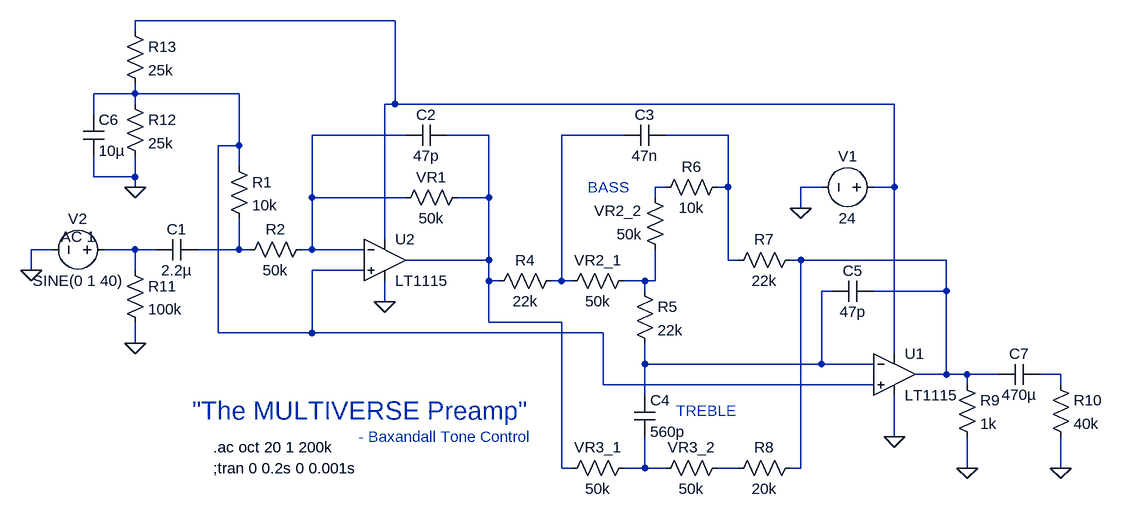
[diagram p0: schematic Baxandall Tone Control.asc]
Baxandall Tone Control.asc, the LTspice schematic file:
Version 4
SHEET 1 880 680
WIRE -432 -416 -832 -416
WIRE -832 -400 -832 -416
WIRE -832 -304 -832 -320
WIRE -832 -304 -896 -304
WIRE -672 -304 -832 -304
WIRE -832 -288 -832 -304
WIRE -432 -288 -432 -416
WIRE -432 -288 -448 -288
WIRE 336 -288 -432 -288
WIRE -896 -272 -896 -304
WIRE -416 -240 -560 -240
WIRE -288 -240 -352 -240
WIRE -80 -240 -176 -240
WIRE 80 -240 -16 -240
WIRE -672 -224 -672 -304
WIRE -672 -224 -704 -224
WIRE -672 -192 -672 -224
WIRE -896 -176 -896 -208
WIRE -832 -176 -832 -208
WIRE -832 -176 -896 -176
WIRE -832 -160 -832 -176
WIRE -16 -160 -32 -160
WIRE 80 -160 80 -240
WIRE 80 -160 64 -160
WIRE 224 -160 192 -160
WIRE 336 -160 336 -288
WIRE 336 -160 304 -160
WIRE -560 -144 -560 -240
WIRE -416 -144 -560 -144
WIRE -288 -144 -288 -240
WIRE -288 -144 -336 -144
WIRE -32 -144 -32 -160
WIRE 192 -128 192 -160
WIRE -448 -80 -448 -288
WIRE -960 -64 -992 -64
WIRE -832 -64 -880 -64
WIRE -800 -64 -832 -64
WIRE -672 -64 -672 -112
WIRE -672 -64 -736 -64
WIRE -656 -64 -672 -64
WIRE -560 -64 -560 -144
WIRE -560 -64 -576 -64
WIRE -480 -64 -560 -64
WIRE -288 -48 -288 -144
WIRE -288 -48 -416 -48
WIRE 80 -48 80 -160
WIRE 96 -48 80 -48
WIRE 192 -48 176 -48
WIRE 416 -48 192 -48
WIRE -992 -32 -992 -64
WIRE -832 -32 -832 -64
WIRE -480 -32 -560 -32
WIRE -288 -16 -288 -48
WIRE -272 -16 -288 -16
WIRE -176 -16 -176 -240
WIRE -176 -16 -192 -16
WIRE -160 -16 -176 -16
WIRE -48 -16 -80 -16
WIRE -32 -16 -32 -64
WIRE -32 -16 -48 -16
WIRE -48 0 -48 -16
WIRE 240 0 224 0
WIRE 416 0 416 -48
WIRE 416 0 304 0
WIRE -448 16 -448 -16
WIRE -288 48 -288 -16
WIRE -176 48 -288 48
WIRE -704 64 -704 -224
WIRE -560 64 -560 -32
WIRE -560 64 -704 64
WIRE -112 64 -560 64
WIRE -832 80 -832 48
WIRE 336 96 336 -160
WIRE -48 112 -48 80
WIRE 224 112 224 0
WIRE 224 112 -48 112
WIRE 304 112 224 112
WIRE 416 128 416 0
WIRE 416 128 368 128
WIRE 448 128 416 128
WIRE 496 128 448 128
WIRE 592 128 560 128
WIRE -112 144 -112 64
WIRE 304 144 -112 144
WIRE 448 144 448 128
WIRE 592 144 592 128
WIRE -48 160 -48 112
WIRE 336 224 336 160
WIRE -176 272 -176 48
WIRE -160 272 -176 272
WIRE -48 272 -48 224
WIRE -48 272 -80 272
WIRE -16 272 -48 272
WIRE 96 272 64 272
WIRE 192 272 192 -48
WIRE 192 272 176 272
WIRE 448 272 448 224
WIRE 592 272 592 224
FLAG 192 -128 0
FLAG 336 224 0
FLAG -448 16 0
FLAG 448 272 0
FLAG 592 272 0
FLAG -832 80 0
FLAG -992 -32 0
FLAG -832 -160 0
SYMBOL voltage 320 -160 R90
WINDOW 0 -32 56 VBottom 2
WINDOW 3 32 56 VTop 2
WINDOW 123 0 0 Left 2
WINDOW 39 0 0 Left 2
SYMATTR InstName V1
SYMATTR Value 24
SYMBOL res -16 -48 R180
WINDOW 0 36 76 Left 2
WINDOW 3 36 40 Left 2
SYMATTR InstName VR2_2
SYMATTR Value 50k
SYMBOL res 80 256 R90
WINDOW 0 0 56 VBottom 2
WINDOW 3 32 56 VTop 2
SYMATTR InstName VR3_2
SYMATTR Value 50k
SYMBOL res -64 256 R90
WINDOW 0 0 56 VBottom 2
WINDOW 3 32 56 VTop 2
SYMATTR InstName VR3_1
SYMATTR Value 50k
SYMBOL res -64 -32 R90
WINDOW 0 0 56 VBottom 2
WINDOW 3 32 56 VTop 2
SYMATTR InstName VR2_1
SYMATTR Value 50k
SYMBOL cap -64 160 R0
SYMATTR InstName C4
SYMATTR Value 560p
SYMATTR SpiceLine Rser=10m
SYMBOL res -64 -16 R0
SYMATTR InstName R5
SYMATTR Value 22k
SYMBOL res 192 -64 R90
WINDOW 0 0 56 VBottom 2
WINDOW 3 32 56 VTop 2
SYMATTR InstName R7
SYMATTR Value 22k
SYMBOL res -176 -32 R90
WINDOW 0 0 56 VBottom 2
WINDOW 3 32 56 VTop 2
SYMATTR InstName R4
SYMATTR Value 22k
SYMBOL cap -16 -256 R90
WINDOW 0 0 32 VBottom 2
WINDOW 3 32 32 VTop 2
SYMATTR InstName C3
SYMATTR Value 47n
SYMATTR SpiceLine Rser=10m
SYMBOL Opamps\\LT1115 336 64 R0
SYMATTR InstName U1
SYMBOL Opamps\\LT1115 -448 -112 R0
SYMATTR InstName U2
SYMBOL res -432 -128 R270
WINDOW 0 32 56 VTop 2
WINDOW 3 0 56 VBottom 2
SYMATTR InstName VR1
SYMATTR Value 50k
SYMBOL res -672 -48 R270
WINDOW 0 32 56 VTop 2
WINDOW 3 0 56 VBottom 2
SYMATTR InstName R2
SYMATTR Value 50k
SYMBOL cap 304 -16 R90
WINDOW 0 0 32 VBottom 2
WINDOW 3 32 32 VTop 2
SYMATTR InstName C5
SYMATTR Value 47p
SYMBOL res 432 128 R0
SYMATTR InstName R9
SYMATTR Value 1k
SYMBOL res 576 128 R0
SYMATTR InstName R10
SYMATTR Value 40k
SYMBOL res 192 256 R90
WINDOW 0 0 56 VBottom 2
WINDOW 3 32 56 VTop 2
SYMATTR InstName R8
SYMATTR Value 20k
SYMBOL res 80 -176 R90
WINDOW 0 0 56 VBottom 2
WINDOW 3 32 56 VTop 2
SYMATTR InstName R6
SYMATTR Value 10k
SYMBOL res -688 -208 R0
SYMATTR InstName R1
SYMATTR Value 10k
SYMBOL res -848 -48 R0
SYMATTR InstName R11
SYMATTR Value 100k
SYMBOL cap -736 -80 R90
WINDOW 0 0 32 VBottom 2
WINDOW 3 32 32 VTop 2
SYMATTR InstName C1
SYMATTR Value 2.2µ
SYMBOL voltage -864 -64 R90
WINDOW 0 -32 56 VBottom 2
WINDOW 3 32 56 VTop 2
WINDOW 123 -4 56 VBottom 2
WINDOW 39 0 0 Left 2
SYMATTR InstName V2
SYMATTR Value SINE(0 1 40)
SYMATTR Value2 AC 1
SYMBOL res -848 -304 R0
SYMATTR InstName R12
SYMATTR Value 25k
SYMBOL res -848 -416 R0
SYMATTR InstName R13
SYMATTR Value 25k
SYMBOL cap -912 -272 R0
SYMATTR InstName C6
SYMATTR Value 10µ
SYMBOL cap -352 -256 R90
WINDOW 0 0 32 VBottom 2
WINDOW 3 32 32 VTop 2
SYMATTR InstName C2
SYMATTR Value 47p
SYMBOL cap 560 112 R90
WINDOW 0 0 32 VBottom 2
WINDOW 3 32 32 VTop 2
SYMATTR InstName C7
SYMATTR Value 470µ
TEXT -712 240 Left 2 !.ac oct 20 1 200k
TEXT -136 -160 Left 2 ;BASS
TEXT 0 184 Left 2 ;TREBLE
TEXT -712 272 Left 2 !;tran 0 0.2s 0 0.001s
TEXT -744 184 Left 4 ;"The MULTIVERSE Preamp"
TEXT -488 224 Left 2 ;- Baxandall Tone Control

The netlist it stands for:
* Baxandall Tone Control.asc
V1 N001 0 24
R§VR2_2 N011 N007 50k
R§VR3_2 N015 N014 50k
R§VR3_1 N014 N004 50k
R§VR2_1 N011 N005 50k
C4 N012 N014 560p Rser=10m
R5 N011 N012 22k
R7 N010 N006 22k
R4 N005 N004 22k
C3 N006 N005 47n Rser=10m
XU1 N002 N012 N001 0 N010 LT1028  ; LT1115, pins In+ In- V+ V- OUT
XU2 N002 N003 N001 0 N004 LT1028  ; LT1115, pins In+ In- V+ V- OUT
R§VR1 N003 N004 50k
R2 N009 N003 50k
C5 N010 N012 47p
R9 N010 0 1k
R10 N013 0 40k
R8 N010 N015 20k
R6 N006 N007 10k
R1 N002 N009 10k
R11 N008 0 100k
C1 N009 N008 2.2µ
V2 N008 0 SINE(0 1 40) AC 1
R12 N002 0 25k
R13 N001 N002 25k
C6 N002 0 10µ
C2 N004 N003 47p
C7 N013 N010 470µ
.ac oct 20 1 200k
* BASS
* TREBLE
;tran 0 0.2s 0 0.001s
* "The MULTIVERSE Preamp"
* - Baxandall Tone Control
.lib LTC.lib
.backanno
.end